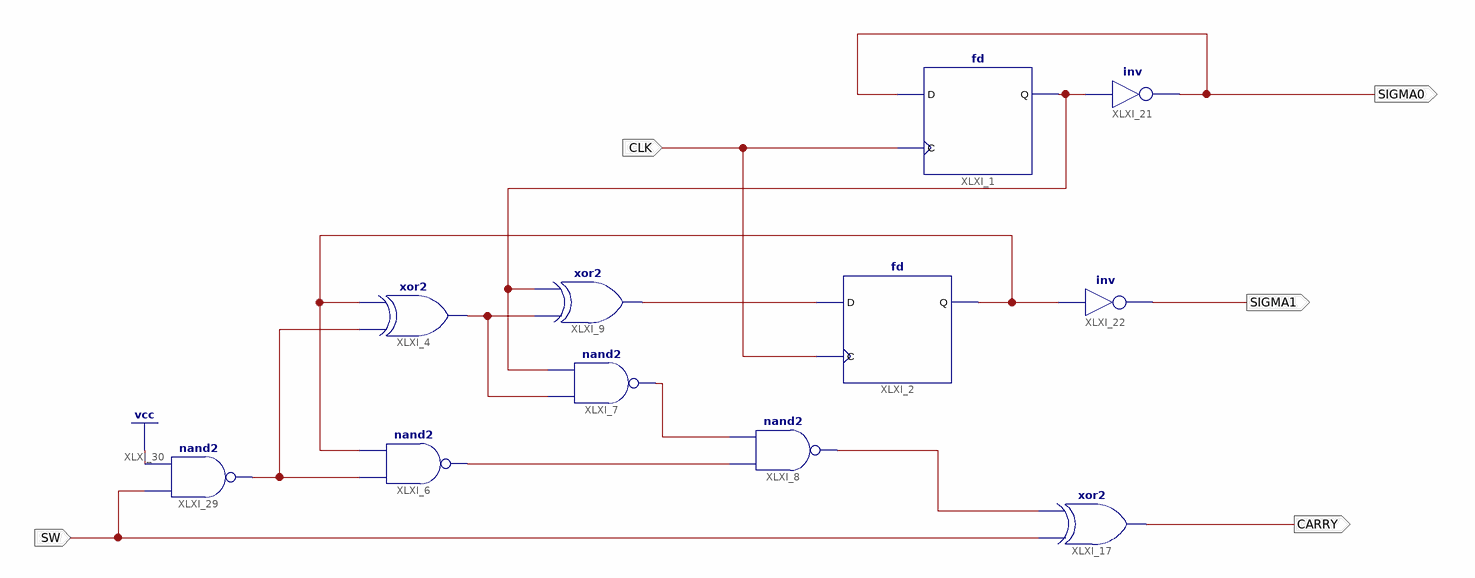
[diagram p0: schematic sheet 1]
// Xilinx ISE schematic UPDOWN_CNT2.sch (spartan6) as structural Verilog: 11 symbols, 5 ports
module UPDOWN_CNT2 (
  input  CLK,
  input  SW,
  output CARRY,
  output SIGMA1,
  output SIGMA0
);

  wire SIGMA011, SIGMA111, XLXN_9, XLXN_23, XLXN_25, XLXN_26, XLXN_58, XLXN_59;

  fd XLXI_1 (.C(CLK), .D(SIGMA0), .Q(SIGMA011));
  fd XLXI_2 (.C(CLK), .D(XLXN_26), .Q(SIGMA111));
  xor XLXI_4 (XLXN_9, XLXN_59, SIGMA111);
  nand XLXI_6 (XLXN_25, XLXN_59, SIGMA111);
  nand XLXI_7 (XLXN_23, XLXN_9, SIGMA011);
  nand XLXI_8 (XLXN_58, XLXN_25, XLXN_23);
  xor XLXI_9 (XLXN_26, XLXN_9, SIGMA011);
  xor XLXI_17 (CARRY, SW, XLXN_58);
  not XLXI_21 (SIGMA0, SIGMA011);
  not XLXI_22 (SIGMA1, SIGMA111);
  nand XLXI_29 (XLXN_59, SW, 1'b1);
endmodule
